# EAGLE design 4-KEY-KEYBOARD (EAGLE 9.6.2)
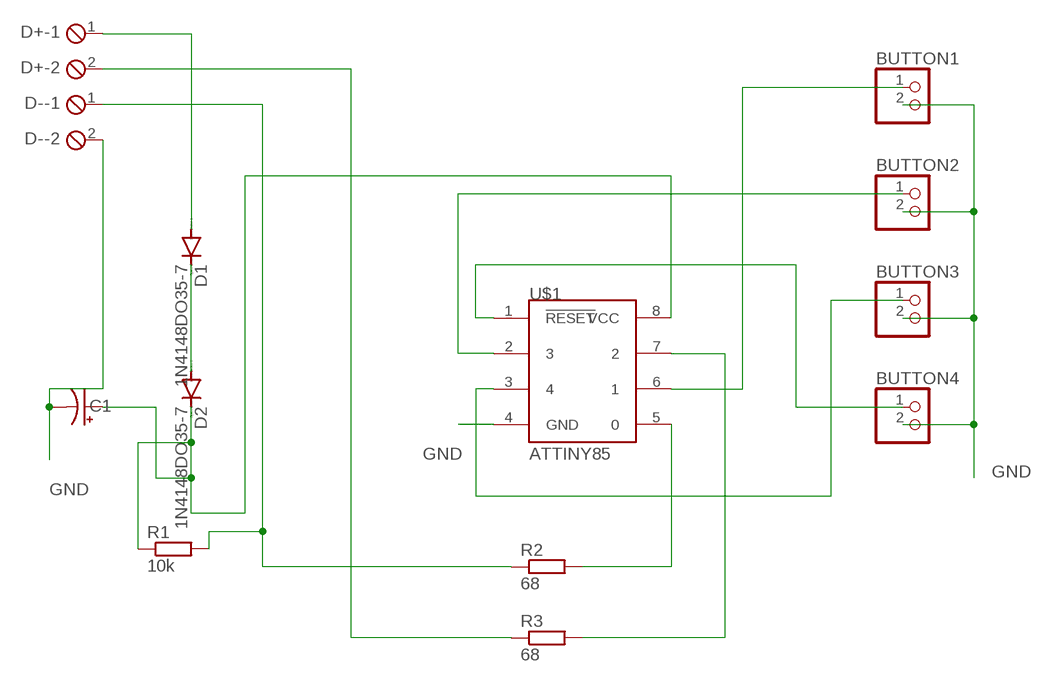
[diagram p0: schematic, sheet 1]

## Parts
BUTTON1  PINHD-1X2  [1X02]
BUTTON2  PINHD-1X2  [1X02]
BUTTON3  PINHD-1X2  [1X02]
BUTTON4  PINHD-1X2  [1X02]
C1  CPOL-USE2.5-6  [E2,5-6]
D1  1N4148DO35-7  [DO35-7]
D2  1N4148DO35-7  [DO35-7]
D+  MPT2  [2POL254]
D-  MPT2  [2POL254]
R1  10k  R-EU_0204/7  [0204/7]
R2  68  R-EU_0204/7  [0204/7]
R3  68  R-EU_0204/7  [0204/7]
U$1  ATTINY85  [8P3]

## Nets
GND: BUTTON1.2 BUTTON2.2 BUTTON3.2 BUTTON4.2 C1.- D-.2 U$1.4(GND)
N$1: BUTTON1.1 U$1.6
N$2: BUTTON2.1 U$1.2
N$3: BUTTON3.1 U$1.3
N$4: BUTTON4.1 U$1.1(!RESET)
N$5: D1.A D+.1
N$6: D1.C D2.A
N$7: C1.+ D2.C R1.1 U$1.8(VCC)
N$8: R2.2 U$1.5
N$9: D-.1 R1.2 R2.1
N$10: R3.2 U$1.7
N$11: D+.2 R3.1

## Library data of the parts
BUTTON1-BUTTON4 = pinhead:PINHD-1X2: PIN HEADER
C1 = rcl:CPOL-US: POLARIZED CAPACITOR, American symbol; SPICEPREFIX: C
D1 D2 = diode:1N4148: DIODE high speed (Philips)
D+ D- = con-phoenix-254:MPT2: PHOENIX CONNECTOR; OC_FARNELL: unknown; OC_NEWARK: unknown
R1-R3 = rcl:R-EU_: RESISTOR, European symbol; SPICEPREFIX: R
U$1 = attiny85:ATTINY85

## Board
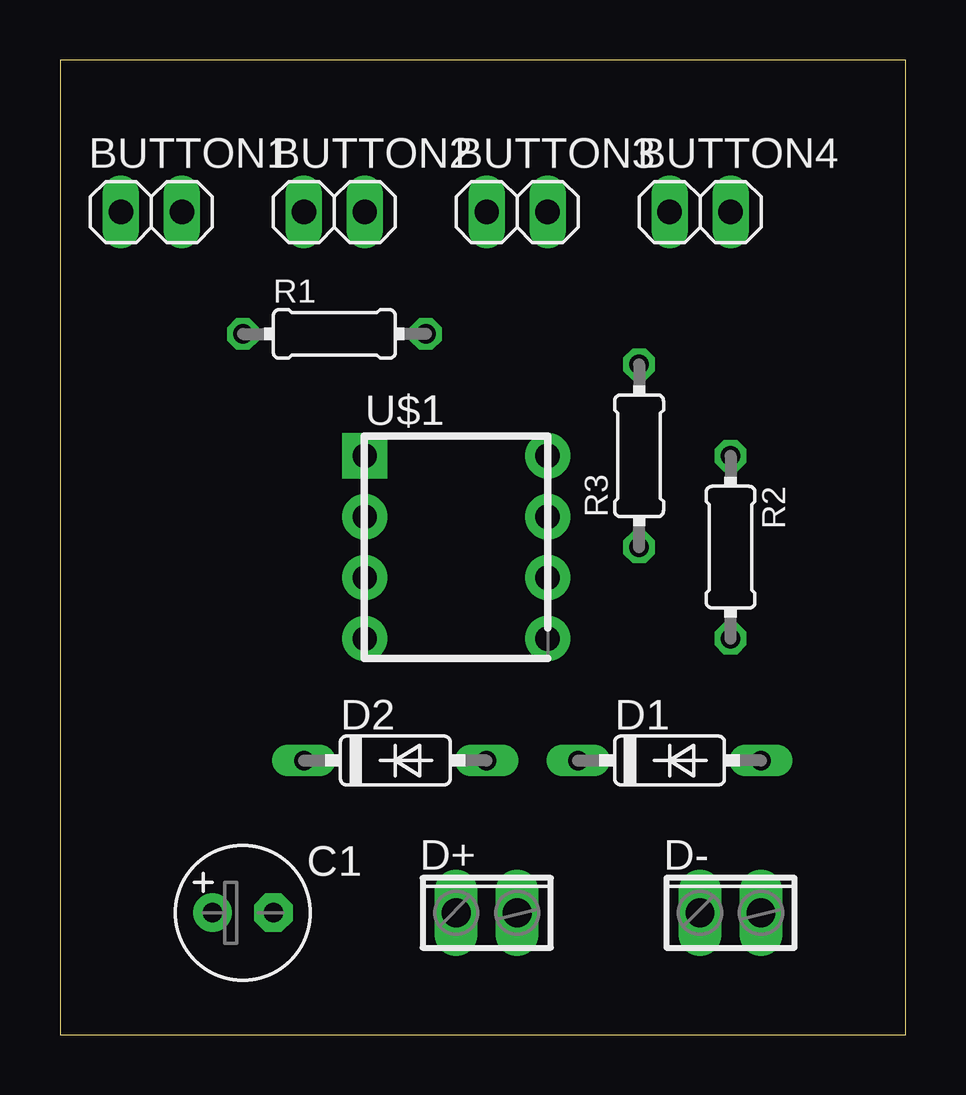
[diagram p1: board, top side]
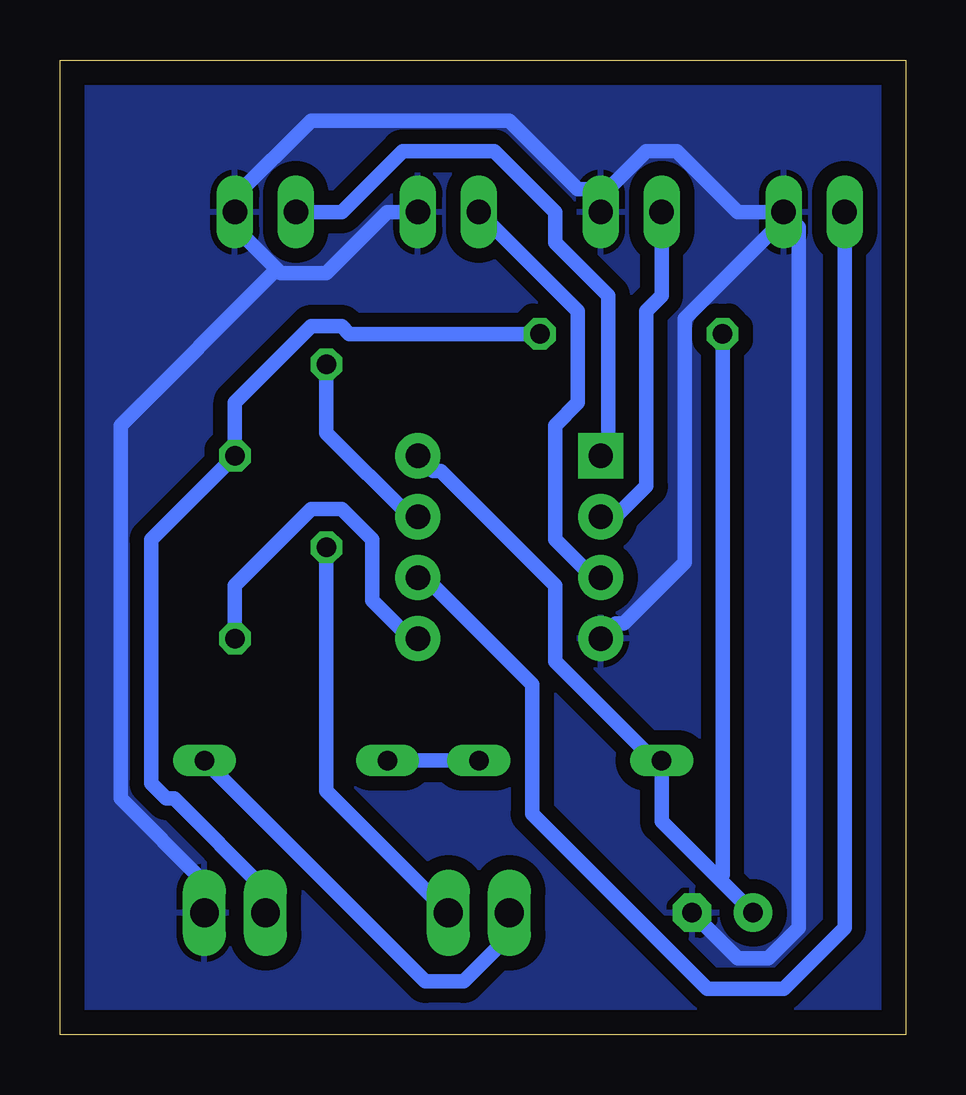
[diagram p2: board, bottom side, seen from below]

Size 35.23 x 40.63 mm. Coordinates in mm from the lower left corner, seen from the top.
Outline: 0,0 35.23,0 35.23,40.63 0,40.63 0,0
Copper layers (1*16): Top 0.035mm / dielectric 1.5mm / Bottom 0.035mm
Design rules "default *": minimum track width 0.6mm, minimum drill 0.3mm, track to track 0.6mm, track to pad 0.6mm, pad to pad 0.6mm, via to via 0.6mm, smd to smd 0.6mm, copper to edge 40mil, drill to drill 0.6mm, minimum pad ring 10mil, minimum via ring 8mil, stop-mask expansion 4mil, vias tented up to drill 0mil, thermal gap 10mil

### Footprints (pad centres in the part's own frame; a part is rotated, then mirrored left to right if it is on the bottom)
1X02 = drill 1.016 long: 1 -1.27,0; 2 1.27,0
E2,5-6 = drill 0.813 pad 1.6: + -1.27,0 | drill 0.813 pad 1.6 octagon: - 1.27,0
DO35-7 = drill 0.813 long: A 3.81,0; C -3.81,0
2POL254 = drill 1.2 long: 1 -1.27,0; 2 1.27,0
0204/7 = drill 0.813 octagon: 1 -3.81,0; 2 3.81,0
8P3 = drill 1.016 pad 1.88 square: 1 -3.81,3.81 | drill 1.016 pad 1.88: 2 -3.81,1.27; 3 -3.81,-1.27; 4 -3.81,-3.81; 5 3.81,-3.81; 6 3.81,-1.27; 7 3.81,1.27; 8 3.81,3.81

### Placement (x,y rotation side)
BUTTON1  3.81,34.29 0 top
BUTTON2  11.43,34.29 0 top
BUTTON3  19.05,34.29 0 top
BUTTON4  26.67,34.29 0 top
C1  7.62,5.08 0 top
D1  25.4,11.43 0 top
D2  13.97,11.43 0 top
D+  17.78,5.08 0 top
D-  27.94,5.08 0 top
R1  11.43,29.21 0 top
R2  27.94,20.32 270 top
R3  24.13,24.13 90 top
U$1  16.51,20.32 0 top

### Tracks (layer width: path | path; a pad name or v marks a point on that pad's centre or on a via)
GND
  Bottom 0.6: BUTTON1.2 6.98,34.29 9.53,36.83 10.79,36.83 12.7,34.92 BUTTON2.2 12.7,35.24 13.65,35.24 16.51,38.1 24.77,38.1 27.94,34.92 BUTTON4.2 27.94,33.66 26.19,31.91 | C1.- 6.98,3.17 5.71,3.17 4.45,4.45 4.45,33.66 BUTTON1.2 | U$1.4 12.06,17.14 11.75,17.14 9.21,19.68 9.21,29.84 5.08,33.97 BUTTON1.2 | BUTTON3.2 21.59,34.29 24.13,31.75 26.04,31.75 26.19,31.91 | D-.2 29.21,6.35 32.7,9.84 32.7,25.4 26.19,31.91
  pour Bottom: 0,40.64 35.56,40.64 35.56,0 0,0
N$1
  Bottom 0.6: BUTTON1.1 2.54,4.45 5.08,1.91 8.25,1.91 15.56,9.21 15.56,14.61 20,19.05 U$1.6
N$2
  Bottom 0.6: BUTTON2.1 10.16,30.8 10.79,30.16 10.79,22.86 12.06,21.59 U$1.2
N$3
  Bottom 0.6: BUTTON3.1 13.65,30.16 13.65,26.35 14.6,25.4 14.6,20.64 13.02,19.05 U$1.3
N$4
  Bottom 0.6: BUTTON4.1 23.5,34.29 20.96,36.83 17.14,36.83 14.6,34.29 14.6,33.02 12.38,30.8 12.38,24.45 U$1.1
N$5
  Bottom 0.6: D1.A 20,2.22 18.42,2.22 16.51,4.13 D+.1
N$6
  Bottom 0.6: D1.C D2.A
N$7
  Bottom 0.6: 10.16,11.11 10.16,8.89 7.78,6.51 | C1.+ 7.78,6.51 | R1.1 7.62,6.67 7.78,6.51 | U$1.8 19.69,23.5 19.37,23.5 14.6,18.73 14.6,15.56 10.16,11.11 | 10.16,11.11 D2.C
N$8
  Bottom 0.6: R2.2 27.94,18.73 24.77,21.91 23.5,21.91 22.23,20.64 22.23,18.1 20.64,16.51 U$1.5
N$9
  Bottom 0.6: R1.2 23.18,29.21 23.5,29.53 24.77,29.53 27.94,26.35 R2.1 31.43,20.64 31.43,10.48 30.8,9.84 30.48,9.84 26.67,6.03 D-.1
N$10
  Bottom 0.6: R3.2 24.13,25.08 20.64,21.59 U$1.7
N$11
  Bottom 0.6: R3.1 24.13,10.16 D+.2